# Altium project DriverPCB.PrjPcb
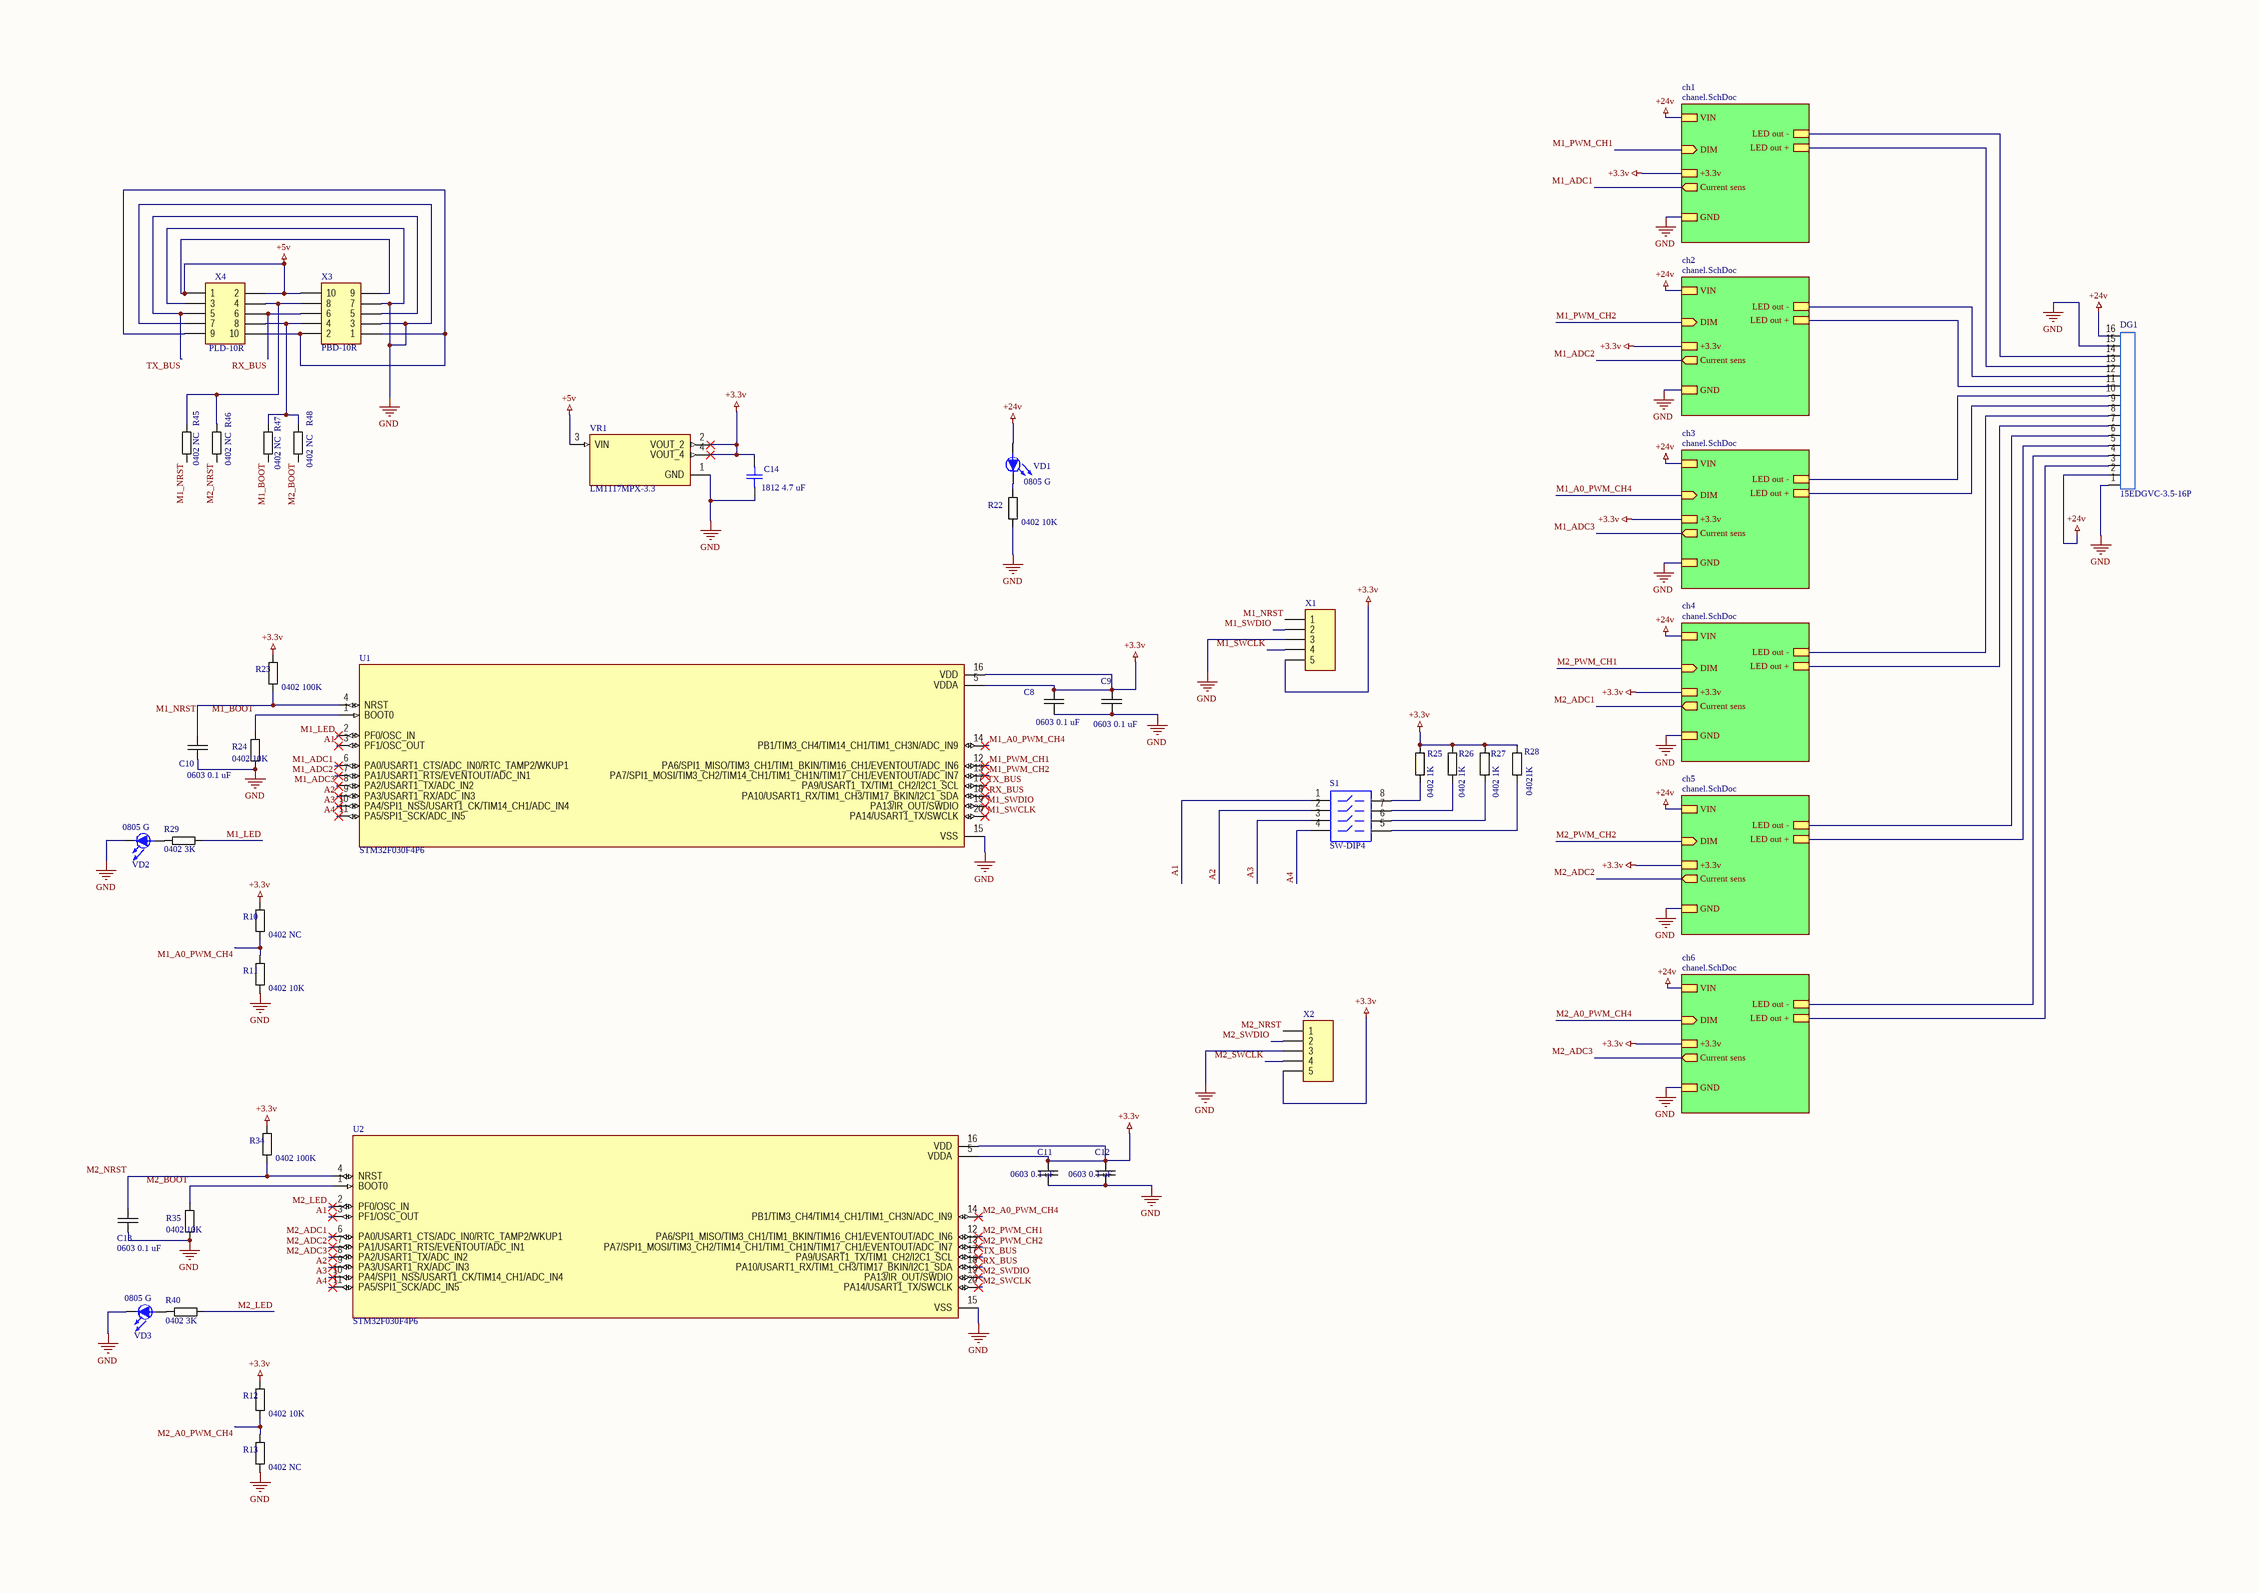
[diagram p0: DriverPCB.SchDoc]
2 sheets, 182 parts. Net scope: hierarchical (ports join the sheet entries above them; power ports are global).
Board file: DriverPCB.PcbDoc
Sheets:
  DriverPCB.SchDoc
    ch1 = chanel.SchDoc
    ch2 = chanel.SchDoc
    ch3 = chanel.SchDoc
    ch4 = chanel.SchDoc
    ch5 = chanel.SchDoc
    ch6 = chanel.SchDoc

## Sheet DriverPCB.SchDoc
size A2; Scale: 1:1; Обозначение документа: АБВГ.123456.001Э3; Разраб.: Иванов; Пров.: Петров; Утв.: Сидоров; Наименование организации: ОАО "Ваша фирма"; Перв. применение: АБВГ.123456.000; Наименование изделия 1: Плата; Наименование изделия 2: Схема электрическая; Наименование изделия 3: принципиальная; Нач. отд.: Нач. отд.; Фамилия нач. отд.: Сидоров

### Parts
C8  0603 0.1 uF  [CAPACITOR 0603]
C9  0603 0.1 uF  [CAPACITOR 0603]
C10  0603 0.1 uF  [CAPACITOR 0603]
C11  0603 0.1 uF  [CAPACITOR 0603]
C12  0603 0.1 uF  [CAPACITOR 0603]
C13  0603 0.1 uF  [CAPACITOR 0603]
C14  1812 4.7 uF  [CAPCHIP1812]
DG1  15EDGVC-3.5-16P  [15EDGVC-3.5-16P]
R10  0402 NC  [Resistor 0402]
R11  0402 10K  [Resistor 0402]
R12  0402 10K  [Resistor 0402]
R13  0402 NC  [Resistor 0402]
R22  0402 10K  [Resistor 0402]
R23  0402 100K  [Resistor 0402]
R24  0402 10K  [Resistor 0402]
R25  0402 1K  [Resistor 0402]
R26  0402 1K  [Resistor 0402]
R27  0402 1K  [Resistor 0402]
R28  04021K  [Resistor 0402]
R29  0402 3K  [Resistor 0402]
R34  0402 100K  [Resistor 0402]
R35  0402 10K  [Resistor 0402]
R40  0402 3K  [Resistor 0402]
R45  0402 NC  [Resistor 0402]
R46  0402 NC  [Resistor 0402]
R47  0402 NC  [Resistor 0402]
R48  0402 NC  [Resistor 0402]
S1  SW-DIP4  [DIP-8]
U1  STM32F030F4P6  [SOP65P640X120-20N]
U2  STM32F030F4P6  [SOP65P640X120-20N]
VD1  0805 G  [0805-]
VD2  0805 G  [0805-]
VD3  0805 G  [0805-]
VR1  LM1117MPX-3.3  [VREG_LM1117MPX-3.3]
X1  (no value)  [PLS-5-3D]
X2  (no value)  [PLS-5-3D]
X3  PBD-10R  [PBD-10RR]
X4  PLD-10R  [PLD-10RR2]

### Sub-sheets
ch1 = chanel.SchDoc: VIN, GND, LED out +, LED out -, DIM (in), +3.3v, Current sens (out)
ch2 = chanel.SchDoc: VIN, GND, LED out +, LED out -, DIM (in), +3.3v, Current sens (out)
ch3 = chanel.SchDoc: VIN, GND, LED out +, LED out -, DIM (in), +3.3v, Current sens (out)
ch4 = chanel.SchDoc: VIN, GND, LED out +, LED out -, DIM (in), +3.3v, Current sens (out)
ch5 = chanel.SchDoc: VIN, GND, LED out +, LED out -, DIM (in), +3.3v, Current sens (out)
ch6 = chanel.SchDoc: VIN, GND, LED out +, LED out -, DIM (in), +3.3v, Current sens (out)

### Nets
+3.3v: C8.1 C9.1 C11.1 C12.1 C14.2 R10.2 R12.2 R23.2 R25.1 R26.1 R27.1 R28.1 R34.2 U1.5(VDDA) U1.16(VDD) U2.5(VDDA) U2.16(VDD) VR1.2(VOUT_2) VR1.4(VOUT_4) X1.5 X2.5 ; sheet ch1/+3.3v, sheet ch2/+3.3v, sheet ch3/+3.3v, sheet ch4/+3.3v, sheet ch5/+3.3v, sheet ch6/+3.3v
+5v: VR1.3(VIN) X3.9 X3.10 X4.1 X4.2
+24v: DG1.2 DG1.16 VD1.A(a) ; sheet ch1/VIN, sheet ch2/VIN, sheet ch3/VIN, sheet ch4/VIN, sheet ch5/VIN, sheet ch6/VIN  [project net Vin]
gnd: C8.2 C9.2 C10.1 C11.2 C12.2 C13.1 C14.1 DG1.1 DG1.15 R11.1 R13.1 R22.1 R24.2 R35.2 U1.15(VSS) U2.15(VSS) VD2.K(k) VD3.K(k) VR1.1(GND) X1.3 X2.3 X3.3 X3.7 X4.3 X4.7 ; sheet ch1/GND, sheet ch2/GND, sheet ch3/GND, sheet ch4/GND, sheet ch5/GND, sheet ch6/GND
A1: S1.1 U1.3(PF1/OSC_OUT) U2.3(PF1/OSC_OUT)
A2: S1.2 U1.9(PA3/USART1_RX/ADC_IN3) U2.9(PA3/USART1_RX/ADC_IN3)
A3: S1.3 U1.10(PA4/SPI1_NSS/USART1_CK/TIM14_CH1/ADC_IN4) U2.10(PA4/SPI1_NSS/USART1_CK/TIM14_CH1/ADC_IN4)
A4: S1.4 U1.11(PA5/SPI1_SCK/ADC_IN5) U2.11(PA5/SPI1_SCK/ADC_IN5)
M1_A0_PWM_CH4: R10.1 R11.2 U1.14(PB1/TIM3_CH4/TIM14_CH1/TIM1_CH3N/ADC_IN9) ; sheet ch3/DIM
M1_ADC1: U1.6(PA0/USART1_CTS/ADC_IN0/RTC_TAMP2/WKUP1) ; sheet ch1/Current sens
M1_ADC2: U1.7(PA1/USART1_RTS/EVENTOUT/ADC_IN1) ; sheet ch2/Current sens
M1_ADC3: U1.8(PA2/USART1_TX/ADC_IN2) ; sheet ch3/Current sens
M1_BOOT: R24.1 R47.2 U1.1(BOOT0)
M1_LED: R29.1 U1.2(PF0/OSC_IN)
M1_NRST: C10.2 R23.1 R45.2 U1.4(NRST) X1.1
M1_PWM_CH1: U1.12(PA6/SPI1_MISO/TIM3_CH1/TIM1_BKIN/TIM16_CH1/EVENTOUT/ADC_IN6) ; sheet ch1/DIM
M1_PWM_CH2: U1.13(PA7/SPI1_MOSI/TIM3_CH2/TIM14_CH1/TIM1_CH1N/TIM17_CH1/EVENTOUT/ADC_IN7) ; sheet ch2/DIM
M1_SWCLK: U1.20(PA14/USART1_TX/SWCLK) X1.4
M1_SWDIO: U1.19(PA13/IR_OUT/SWDIO) X1.2
M2_A0_PWM_CH4: R12.1 R13.2 U2.14(PB1/TIM3_CH4/TIM14_CH1/TIM1_CH3N/ADC_IN9) ; sheet ch6/DIM
M2_ADC1: U2.6(PA0/USART1_CTS/ADC_IN0/RTC_TAMP2/WKUP1) ; sheet ch4/Current sens
M2_ADC2: U2.7(PA1/USART1_RTS/EVENTOUT/ADC_IN1) ; sheet ch5/Current sens
M2_ADC3: U2.8(PA2/USART1_TX/ADC_IN2) ; sheet ch6/Current sens
M2_BOOT: R35.1 R48.2 U2.1(BOOT0)
M2_LED: R40.1 U2.2(PF0/OSC_IN)
M2_NRST: C13.2 R34.1 R46.2 U2.4(NRST) X2.1
M2_PWM_CH1: U2.12(PA6/SPI1_MISO/TIM3_CH1/TIM1_BKIN/TIM16_CH1/EVENTOUT/ADC_IN6) ; sheet ch4/DIM
M2_PWM_CH2: U2.13(PA7/SPI1_MOSI/TIM3_CH2/TIM14_CH1/TIM1_CH1N/TIM17_CH1/EVENTOUT/ADC_IN7) ; sheet ch5/DIM
M2_SWCLK: U2.20(PA14/USART1_TX/SWCLK) X2.4
M2_SWDIO: U2.19(PA13/IR_OUT/SWDIO) X2.2
RX_BUS: U1.18(PA10/USART1_RX/TIM1_CH3/TIM17_BKIN/I2C1_SDA) U2.18(PA10/USART1_RX/TIM1_CH3/TIM17_BKIN/I2C1_SDA) X3.6 X4.6
TX_BUS: U1.17(PA9/USART1_TX/TIM1_CH2/I2C1_SCL) U2.17(PA9/USART1_TX/TIM1_CH2/I2C1_SCL) X3.5 X4.5
NetC5_ch1_1: DG1.14 ; sheet ch1/LED out -
NetC5_ch1_2: DG1.13 ; sheet ch1/LED out +
NetC5_ch2_1: DG1.12 ; sheet ch2/LED out -
NetC5_ch2_2: DG1.11 ; sheet ch2/LED out +
NetC5_ch3_1: DG1.10 ; sheet ch3/LED out -
NetC5_ch3_2: DG1.9 ; sheet ch3/LED out +
NetC5_ch4_1: DG1.8 ; sheet ch4/LED out -
NetC5_ch4_2: DG1.7 ; sheet ch4/LED out +
NetC5_ch5_1: DG1.6 ; sheet ch5/LED out -
NetC5_ch5_2: DG1.5 ; sheet ch5/LED out +
NetC5_ch6_1: DG1.4 ; sheet ch6/LED out -
NetC5_ch6_2: DG1.3 ; sheet ch6/LED out +
NetR22_2: R22.2 VD1.K(k)
NetR25_2: R25.2 S1.8
NetR26_2: R26.2 S1.7
NetR27_2: R27.2 S1.6
NetR28_2: R28.2 S1.5
NetR29_2: R29.2 VD2.A(a)
NetR40_2: R40.2 VD3.A(a)
NetR45_1: R45.1 R46.1 X3.8 X4.4
NetR47_1: R47.1 R48.1 X3.4 X4.8
NetX3_1: X3.1 X3.2 X4.9 X4.10

### Notes on the sheet
- Перв. примен.
- Справ. №
- Подп. и дата
- Инв. № дубл.
- Взам. инв. №
- Разраб.
- Изм.
- Лист
- № докум.
- Подп.
- Дата
- Лит.
- Масса
- Масштаб
- Пров.
- Т.контр.
- Листов
- Инв. № подл.
- Утв.
- Н.контр.
- Копировал
- Формат А3

### Library data of the parts
C8-C13 = Capasitor: Ceramic Capacitor; Value: 0603 0.1 uF; Package: 0603
C14 = Cap C: Ceramic Capacitor; Class: Электронные компоненты; SubClass: Конденсаторы; TKE: {TKE}; Ordering_Information: {Ordering_Information}; Installation: {Installation}; Body: {Body}; Nominal_voltage_V: {Nominal_voltage_V}; Tolerance_Percent: {Tolerance_Percent}; Pins: {Pins}; Value: 1812 4.7 uF; Package: 1812
DG1 = 15EDGVC-3.5-16P: Value: NC
R10-R13 R22-R29 R34 R35 R40 R45-R48 = Resistor: Package: 0402
  R10 R13 R45-R48: Value: 0402 NC
  R11 R12 R22 R24 R35: Value: 0402 10K
  R23 R34: Value: 0402 100K
  R25-R27: Value: 0402 1K
  R28: Value: 04021K
  R29 R40: Value: 0402 3K
S1 = SW-DIP4: DIP Switch; Value: DIP4; Published: 24-Mar-1999; LatestRevisionDate: 17-Jul-2002; LatestRevisionNote: Re-released for DXP Platform.; PackageReference: DIP-8; Publisher: Altium Limited
U1 U2 = STM32F030F4P6: MCU 32-bit STM32F ARM Cortex M0 RISC 16KB Flash 2.5V/3.3V 20-Pin TSSOP Tray; Value: STM32F030F4P6; Availability: Unavailable; Price: None; MP: STM32F030F4P6; Package: None
VD1 = LED SMD: Green; Class: Электронные компоненты; SubClass: Светодиоды; Pitch_mm: {Pitch_mm}; Ordering_Information: {Ordering_Information}; Luminous_intensity_mcd: {Luminous_intensity_mcd}; Diameter_mm: {Diameter_mm}; Color: {Color}; Installation: {Installation}; Body: {Body}; Value: 0805 G; Pins: 2; Package: 0805
VD2 VD3 = LED SMD: Green; CompType: LED; Note: Read; Value: 0805 G; Pins: 2; Package: 0805
VR1 = LM1117MPX-3.3: 800-mA 15-V linear voltage regulator; MF: Texas Instruments; Check_prices: https://www.snapeda.com/parts/LM1117MPX-3.3/Texas+Instruments/view-part/?ref=eda; Value: LM1117MPX-3.3; Availability: In Stock; MP: LM1117MPX-3.3; Price: None; Package: SOT-223-4 Texas Instruments; SnapEDA_Link: https://www.snapeda.com/parts/LM1117MPX-3.3/Texas+Instruments/view-part/?ref=snap; Purchase-URL: https://pricing.snapeda.com/search/part/LM1117MPX-3.3/?ref=eda
X1 X2 = PLS-5: Header, 5-Pin; CompType: connector; Note: header pins 2.54mm x 5; Package: 2.54 x 5; PartNumber: PLS-5; Pins: 5
X3 = PBD-10R: Header, 5-Pin, Dual row; Value: KLS1-208-2-10-R; Package: PBD-10R
X4 = PLD-10R: Header, 5-Pin, Dual row; Value: KLS1-207-2-10-R1; Package: PLD-10R

## Sheet chanel.SchDoc
size A2
Used 6 times, as channels ch1, ch2, ch3, ch4, ch5, ch6. Parts and nets are listed once, with the designators drawn on the sheet.
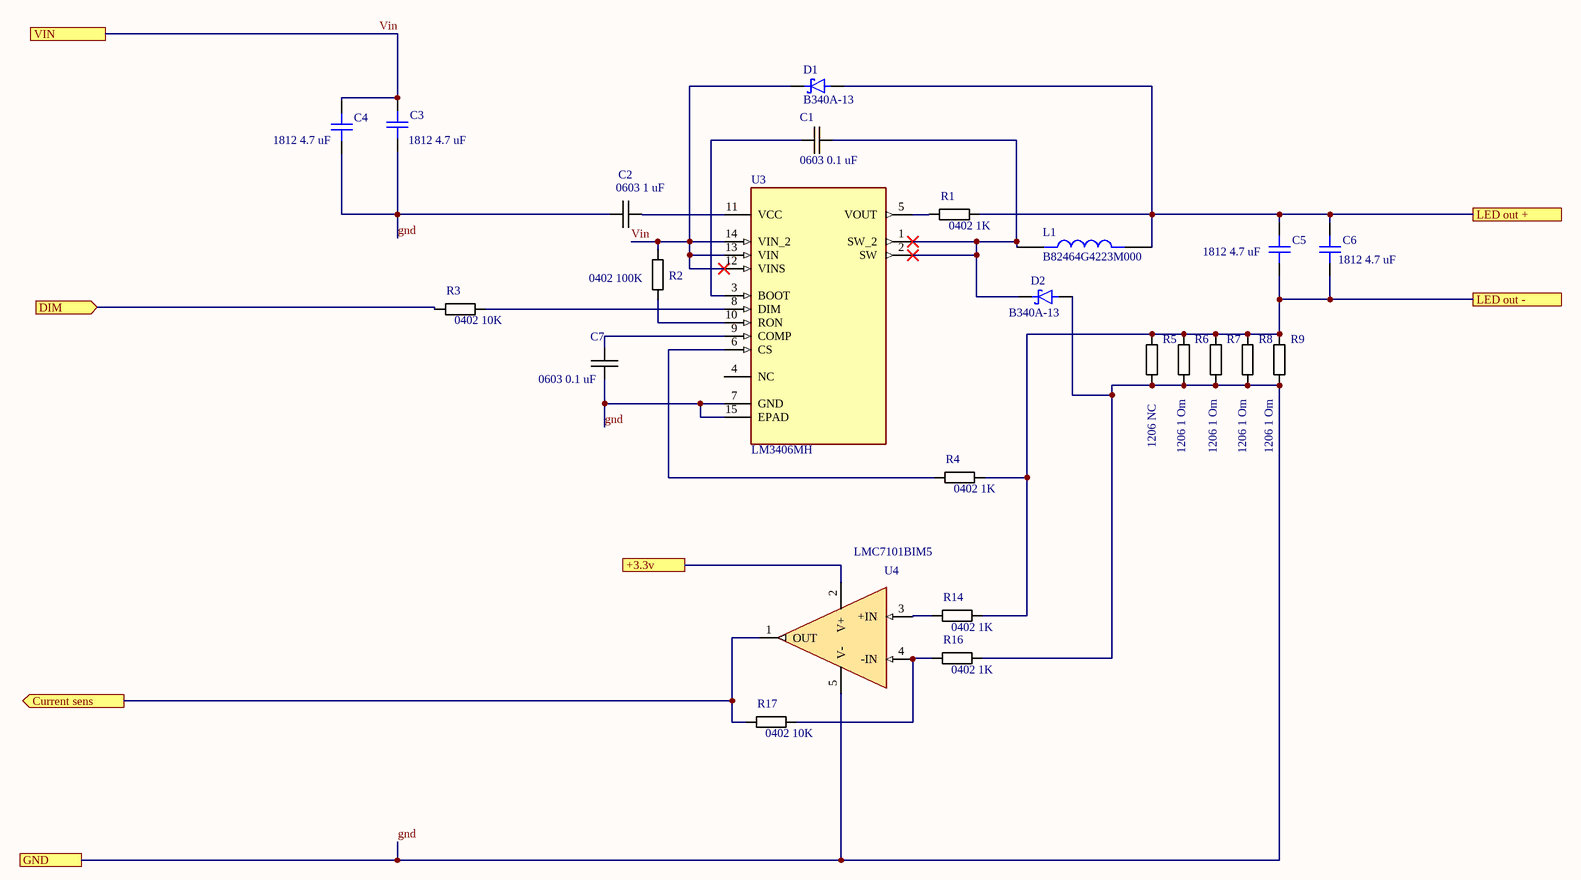
[diagram p1: chanel.SchDoc]

### Parts
C1  0603 0.1 uF  [CAPACITOR 0603]
C2  0603 1 uF  [CAPACITOR 0603]
C3  1812 4.7 uF  [CAPCHIP1812]
C4  1812 4.7 uF  [CAPCHIP1812]
C5  1812 4.7 uF  [CAPCHIP1812]
C6  1812 4.7 uF  [CAPCHIP1812]
C7  0603 0.1 uF  [CAPACITOR 0603]
D1  B340A-13  [DIOM5226X240N]
D2  B340A-13  [DIOM5226X240N]
L1  B82464G4223M000  [IND_B82464G4223M000]
R1  0402 1K  [Resistor 0402]
R2  0402 100K  [Resistor 0402]
R3  0402 10K  [Resistor 0402]
R4  0402 1K  [Resistor 0402]
R5  1206 NC  [Resistor 1206]
R6  1206 1 Om  [Resistor 1206]
R7  1206 1 Om  [Resistor 1206]
R8  1206 1 Om  [Resistor 1206]
R9  1206 1 Om  [Resistor 1206]
R14  0402 1K  [Resistor 0402]
R16  0402 1K  [Resistor 0402]
R17  0402 10K  [Resistor 0402]
U3  LM3406MH  [SOP65P640X110-15N]
U4  LMC7101BIM5  [*SOT95P280X145-5N]

### Ports
+3.3v, Current sens (out), DIM (in), GND, LED out +, LED out -, VIN

### Nets
+3.3v: U4.2(V+) ; port +3.3v
Current sens: R17.2 U4.1(OUT) ; port Current sens
DIM: R3.2 ; port DIM
gnd: C2.2 C3.1 C4.1 C7.2 D2.A R5.2 R6.2 R7.2 R8.2 R9.2 R16.1 U3.7(GND) U3.15(EPAD) U4.5(V-) ; port GND
LED out +: C5.2 C6.2 D1.A L1.2 R1.1 ; port LED out +
LED out -: C5.1 C6.1 R4.1 R5.1 R6.1 R7.1 R8.1 R9.1 R14.1 ; port LED out -
Vin: C3.2 C4.2 D1.C R2.2 U3.12(VINS) U3.13(VIN) U3.14(VIN_2) ; port VIN
NetC1_1: C1.1 D2.C L1.1 U3.1(SW_2) U3.2(SW)
NetC1_2: C1.2 U3.3(BOOT)
NetC2_1: C2.1 U3.11(VCC)
NetC7_1: C7.1 U3.9(COMP)
NetR1_2: R1.2 U3.5(VOUT)
NetR2_1: R2.1 U3.10(RON)
NetR3_1: R3.1 U3.8(DIM)
NetR4_2: R4.2 U3.6(CS)
NetR14_2: R14.2 U4.3(+IN)
NetR16_2: R16.2 R17.1 U4.4(-IN)

Not connected (* = marked no-connect by the designer): U3 4(NC)

### Channels
ch1: designators end in _ch1; ports +3.3v=+3.3v Current sens=M1_ADC1 DIM=M1_PWM_CH1 GND=gnd LED out +=NetC5_ch1_2 LED out -=NetC5_ch1_1 VIN=Vin
ch2: designators end in _ch2; ports +3.3v=+3.3v Current sens=M1_ADC2 DIM=M1_PWM_CH2 GND=gnd LED out +=NetC5_ch2_2 LED out -=NetC5_ch2_1 VIN=Vin
ch3: designators end in _ch3; ports +3.3v=+3.3v Current sens=M1_ADC3 DIM=M1_A0_PWM_CH4 GND=gnd LED out +=NetC5_ch3_2 LED out -=NetC5_ch3_1 VIN=Vin
ch4: designators end in _ch4; ports +3.3v=+3.3v Current sens=M2_ADC1 DIM=M2_PWM_CH1 GND=gnd LED out +=NetC5_ch4_2 LED out -=NetC5_ch4_1 VIN=Vin
ch5: designators end in _ch5; ports +3.3v=+3.3v Current sens=M2_ADC2 DIM=M2_PWM_CH2 GND=gnd LED out +=NetC5_ch5_2 LED out -=NetC5_ch5_1 VIN=Vin
ch6: designators end in _ch6; ports +3.3v=+3.3v Current sens=M2_ADC3 DIM=M2_A0_PWM_CH4 GND=gnd LED out +=NetC5_ch6_2 LED out -=NetC5_ch6_1 VIN=Vin

### Library data of the parts
C1 C2 C7 = Capasitor: Ceramic Capacitor SMD; Package: 0603
  C1 C7: Value: 0603 0.1 uF
  C2: Value: 0603 1 uF
C3-C6 = Cap C: Ceramic Capacitor SMD; Class: Электронные компоненты; SubClass: Конденсаторы; TKE: {TKE}; Ordering_Information: {Ordering_Information}; Installation: {Installation}; Body: {Body}; Nominal_voltage_V: {Nominal_voltage_V}; Tolerance_Percent: {Tolerance_Percent}; Pins: {Pins}; Value: 1812 4.7 uF; Package: 1812
D1 D2 = B340A-13: Diode Schottky 40 V 3A Surface Mount SMA; MF: Diodes Inc.; Value: B340A-13; MP: B340A-13; Package: DO-214 Diodes Inc.; Availability: In Stock; Price: None; SnapEDA_Link: https://www.snapeda.com/parts/B340A-13/Diodes+Inc./view-part/?ref=snap; Check_prices: https://www.snapeda.com/parts/B340A-13/Diodes+Inc./view-part/?ref=eda; Purchase-URL: https://pricing.snapeda.com/search/part/B340A-13/?ref=eda
L1 = B82464G4223M000: MF: TDK ELECTRONICS; Check_prices: https://www.snapeda.com/parts/B82464G4223M000/TM+Electronics/view-part/?ref=eda; Package: None; Value: B82464G4223M000; MP: B82464G4223M000; SnapEDA_Link: https://www.snapeda.com/parts/B82464G4223M000/TM+Electronics/view-part/?ref=snap; Purchase-URL: https://pricing.snapeda.com/search/part/B82464G4223M000/?ref=eda
R1-R9 R14 R16 R17 = Resistor
  R1 R4 R14 R16: Value: 0402 1K; Package: 0402
  R2: Value: 0402 100K; Package: 0402
  R3 R17: Value: 0402 10K; Package: 0402
  R5: Value: 1206 NC; Package: 1206
  R6-R9: Value: 1206 1 Om; Package: 1206
U3 = LM3406MH: Constant Current Buck Regulator; Package: None; Price: None; Value: LM3406MH; MP: LM3406MH; Availability: Unavailable
U4 = LMC7101BIM5: Value: LMC7110BIM5; Check_prices: https://www.snapeda.com/parts/LMC7101BIM5/Texas%20Instruments/view-part/19255/?ref=eda; SnapEDA_Link: https://www.snapeda.com/parts/LMC7101BIM5/Texas%20Instruments/view-part/19255/?ref=snap

## Nets that join several sheets
+3.3v: DriverPCB (21 pins), ch1 (U4_ch1.2), ch2 (U4_ch2.2), ch3 (U4_ch3.2), ch4 (U4_ch4.2), ch5 (U4_ch5.2), ch6 (U4_ch6.2)
gnd: DriverPCB (25 pins), ch1 (14 pins), ch2 (14 pins), ch3 (14 pins), ch4 (14 pins), ch5 (14 pins), ch6 (14 pins)
Vin: DriverPCB (DG1.2 DG1.16 VD1.A), ch1 (7 pins), ch2 (7 pins), ch3 (7 pins), ch4 (7 pins), ch5 (7 pins), ch6 (7 pins)
M1_A0_PWM_CH4: DriverPCB (R10.1 R11.2 U1.14), ch3 (R3_ch3.2)
M1_ADC1: DriverPCB (U1.6), ch1 (R17_ch1.2 U4_ch1.1)
M1_ADC2: DriverPCB (U1.7), ch2 (R17_ch2.2 U4_ch2.1)
M1_ADC3: DriverPCB (U1.8), ch3 (R17_ch3.2 U4_ch3.1)
M1_PWM_CH1: DriverPCB (U1.12), ch1 (R3_ch1.2)
M1_PWM_CH2: DriverPCB (U1.13), ch2 (R3_ch2.2)
M2_A0_PWM_CH4: DriverPCB (R12.1 R13.2 U2.14), ch6 (R3_ch6.2)
M2_ADC1: DriverPCB (U2.6), ch4 (R17_ch4.2 U4_ch4.1)
M2_ADC2: DriverPCB (U2.7), ch5 (R17_ch5.2 U4_ch5.1)
M2_ADC3: DriverPCB (U2.8), ch6 (R17_ch6.2 U4_ch6.1)
M2_PWM_CH1: DriverPCB (U2.12), ch4 (R3_ch4.2)
M2_PWM_CH2: DriverPCB (U2.13), ch5 (R3_ch5.2)
NetC5_ch1_1: DriverPCB (DG1.14), ch1 (9 pins)
NetC5_ch1_2: DriverPCB (DG1.13), ch1 (5 pins)
NetC5_ch2_1: DriverPCB (DG1.12), ch2 (9 pins)
NetC5_ch2_2: DriverPCB (DG1.11), ch2 (5 pins)
NetC5_ch3_1: DriverPCB (DG1.10), ch3 (9 pins)
NetC5_ch3_2: DriverPCB (DG1.9), ch3 (5 pins)
NetC5_ch4_1: DriverPCB (DG1.8), ch4 (9 pins)
NetC5_ch4_2: DriverPCB (DG1.7), ch4 (5 pins)
NetC5_ch5_1: DriverPCB (DG1.6), ch5 (9 pins)
NetC5_ch5_2: DriverPCB (DG1.5), ch5 (5 pins)
NetC5_ch6_1: DriverPCB (DG1.4), ch6 (9 pins)
NetC5_ch6_2: DriverPCB (DG1.3), ch6 (5 pins)